# Altium schematic sheet CH32FVx0xR-NFC-EVT-R0-1v2.SchDoc
size 406 x 281 mm; SheetNumber: 0; SheetTotal: 0
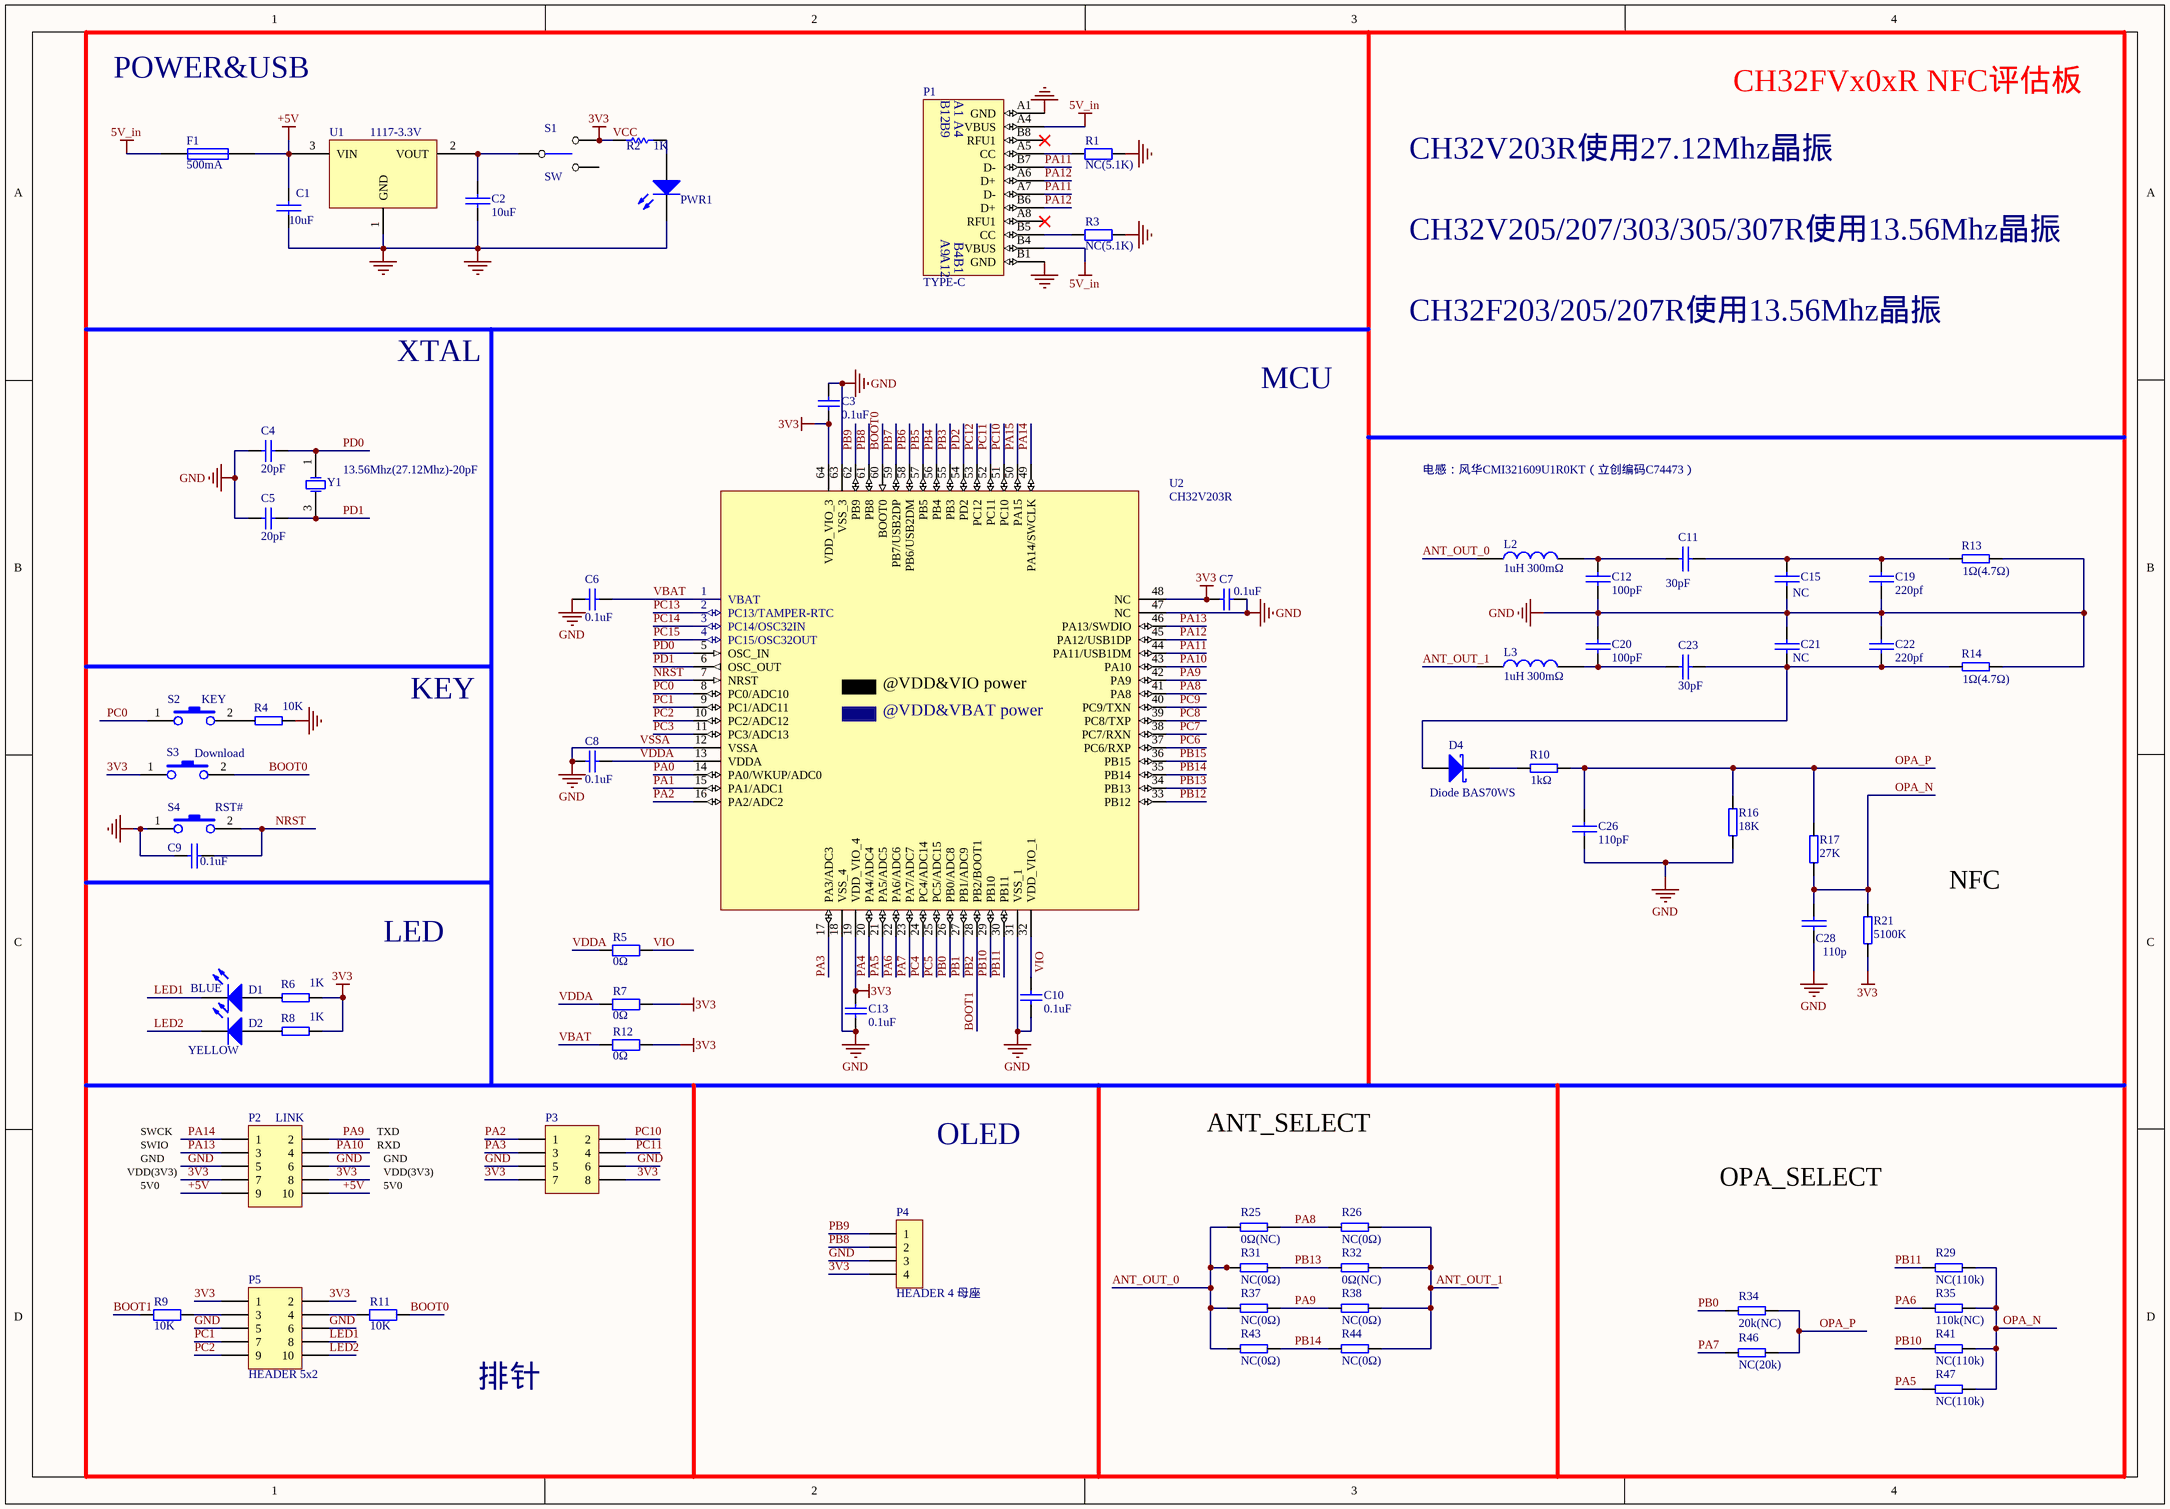
[diagram p0: CH32FVx0xR-NFC-EVT-R0-1v2.SchDoc]

## Parts
C1  10uF  [3216_C]
C2  10uF  [3216_C]
C3  0.1uF  [0603_C]
C4  20pF  [0603_C]
C5  20pF  [0603_C]
C6  0.1uF  [0603_C]
C7  0.1uF  [0603_C]
C8  0.1uF  [0603_C]
C9  0.1uF  [0603_C]
C10  0.1uF  [0603_C]
C11  30pF  [0603_C]
C12  100pF  [0603_C]
C13  0.1uF  [0603_C]
C15  NC  [0603_C]
C19  220pf  [0603_C]
C20  100pF  [0603_C]
C21  NC  [0603_C]
C22  220pf  [0603_C]
C23  30pF  [0603_C]
C26  110pF  [0603_C]
C28  110p  [0603_C]
D1  BLUE  [0603+]
D2  YELLOW  [0603+]
D4  Diode BAS70WS  [3528+]
F1  500mA  [0805]
L2  1uH 300mΩ  [0805]
L3  1uH 300mΩ  [0805]
P1  TYPE-C  [TYPE-C-Receptacle-2.0]
P2  LINK  [IDC10-2.54mm]
P3  Header 4X2  [IDC8-2.54mm]  (value not drawn)
P4  HEADER 4 母座  [SIP4-2.54mm]
P5  HEADER 5x2  [IDC10-2.54mm]
PWR1  POWER  red  [0603+]  (value not drawn)
R1  NC(5.1K)  [0603]
R2  1K  [0603]
R3  NC(5.1K)  [0603]
R4  10K  [0603]
R5  0Ω  [0603]
R6  1K  [0603]
R7  0Ω  [0603]
R8  1K  [0603]
R9  10K  [0603]
R10  1kΩ  [0603]
R11  10K  [0603]
R12  0Ω  [0603]
R13  1Ω(4.7Ω)  [0603]
R14  1Ω(4.7Ω)  [0603]
R16  18K  [0603]
R17  27K  [0603]
R21  5100K  [0603]
R25  0Ω(NC)  [0603]
R26  NC(0Ω)  [0603]
R29  NC(110k)  [0603]
R31  NC(0Ω)  [0603]
R32  0Ω(NC)  [0603]
R34  20k(NC)  [0603]
R35  110k(NC)  [0603]
R37  NC(0Ω)  [0603]
R38  NC(0Ω)  [0603]
R41  NC(110k)  [0603]
R43  NC(0Ω)  [0603]
R44  NC(0Ω)  [0603]
R46  NC(20k)  [0603]
R47  NC(110k)  [0603]
S1  SW  [SW1]
S2  KEY  [SMD_6.1x3.65x2.5mm-KEY]
S3  Download  [SMD_6.1x3.65x2.5mm-KEY]
S4  RST#  [SMD_6.1x3.65x2.5mm-KEY]
U1  1117-3.3V  [SOT-223]
U2  CH32V203R  [LQFP64M_10x10]
Y1  13.56Mhz(27.12Mhz)-20pF  [XT3225]

## Nets
3V3: C3.2 C7.2 C13.2 P2.7 P2.8 P3.7 P3.8 P4.4 P5.1 P5.2 R2.2 R6.1 R7.1 R8.1 R12.1 R21.1 S1.3 S3.1 U2.19(VDD_VIO_4) U2.48(NC) U2.64(VDD_VIO_3)  [also labelled VCC]
5V_in: F1.1 P1.A4(VBUS) P1.B4(VBUS)
+5V: C1.1 F1.2 P2.9 P2.10 U1.3(VIN)
GND: C1.2 C2.2 C3.1 C4.1 C5.1 C6.2 C7.1 C8.2 C9.1 C10.1 C12.1 C13.1 C15.1 C19.1 C20.2 C21.2 C22.2 C26.1 C28.1 P1.A1(GND) P1.B1(GND) P2.5 P2.6 P3.5 P3.6 P4.3 P5.5 P5.6 PWR1.2(K) R1.2 R3.2 R4.1 R13.2 R14.2 R16.1 S4.1 U1.1(GND) U2.12(VSSA) U2.18(VSS_4) U2.31(VSS_1) U2.47(NC) U2.63(VSS_3)  [also labelled VSSA]
ANT_OUT_0: L2.1 R25.2 R31.2 R37.2 R43.2
ANT_OUT_1: L3.1 R26.1 R32.1 R38.1 R44.1
BOOT0: R11.2 S3.2 U2.60(BOOT0)
BOOT1: R9.1 U2.28(PB2/BOOT1)  [also labelled PB2]
LED1: D1.2(K) P5.8
LED2: D2.2(K) P5.10
NRST: C9.2 S4.2 U2.7(NRST)
OPA_N: C28.2 R17.1 R21.2 R29.1 R35.1 R41.1 R47.1
OPA_P: C26.2 R10.2 R16.2 R17.2 R34.1 R46.1
PA0: U2.14(PA0/WKUP/ADC0)
PA1: U2.15(PA1/ADC1)
PA2: P3.1 U2.16(PA2/ADC2)
PA3: P3.3 U2.17(PA3/ADC3)
PA4: U2.20(PA4/ADC4)
PA5: R47.2 U2.21(PA5/ADC5)
PA6: R35.2 U2.22(PA6/ADC6)
PA7: R46.2 U2.23(PA7/ADC7)
PA8: R25.1 R26.2 U2.41(PA8)
PA9: P2.2 R37.1 R38.2 U2.42(PA9)
PA10: P2.4 U2.43(PA10)
PA11: P1.A7(D-) P1.B7(D-) U2.44(PA11/USB1DM)
PA12: P1.A6(D+) P1.B6(D+) U2.45(PA12/USB1DP)
PA13: P2.3 U2.46(PA13/SWDIO)
PA14: P2.1 U2.49(PA14/SWCLK)
PA15: U2.50(PA15)
PB0: R34.2 U2.26(PB0/ADC8)
PB1: U2.27(PB1/ADC9)
PB3: U2.55(PB3)
PB4: U2.56(PB4)
PB5: U2.57(PB5)
PB6: U2.58(PB6/USB2DM)
PB7: U2.59(PB7/USB2DP)
PB8: P4.2 U2.61(PB8)
PB9: P4.1 U2.62(PB9)
PB10: R41.2 U2.29(PB10)
PB11: R29.2 U2.30(PB11)
PB12: U2.33(PB12)
PB13: R31.1 R32.2 U2.34(PB13)
PB14: R43.1 R44.2 U2.35(PB14)
PB15: U2.36(PB15)
PC0: S2.1 U2.8(PC0/ADC10)
PC1: P5.7 U2.9(PC1/ADC11)
PC2: P5.9 U2.10(PC2/ADC12)
PC3: U2.11(PC3/ADC13)
PC4: U2.24(PC4/ADC14)
PC5: U2.25(PC5/ADC15)
PC6: U2.37(PC6/RXP)
PC7: U2.38(PC7/RXN)
PC8: U2.39(PC8/TXP)
PC9: U2.40(PC9/TXN)
PC10: P3.2 U2.51(PC10)
PC11: P3.4 U2.52(PC11)
PC12: U2.53(PC12)
PC13: U2.2(PC13/TAMPER-RTC)
PC14: U2.3(PC14/OSC32IN)
PC15: U2.4(PC15/OSC32OUT)
PD0: C4.2 U2.5(OSC_IN) Y1.1(OSC1)
PD1: C5.2 U2.6(OSC_OUT) Y1.3(OSC2)
PD2: U2.54(PD2)
VBAT: C6.1 R12.2 U2.1(VBAT)
VDDA: C8.1 R5.2 R7.2 U2.13(VDDA)
VIO: C10.2 R5.1 U2.32(VDD_VIO_1)
NetC2_1: C2.1 S1.1 U1.2(VOUT)
NetC11_1: C11.1 C12.2 L2.2
NetC11_2: C11.2 C15.2 C19.2 R13.1
NetC20_1: C20.1 C23.1 L3.2
NetC21_1: C21.1 C22.1 C23.2 D4.1(A) R14.1
NetD1_1: D1.1(A) R6.2
NetD2_1: D2.1(A) R8.2
NetD4_2: D4.2(K) R10.1
NetP1_A5: P1.A5(CC) R1.1
NetP1_B5: P1.B5(CC) R3.1
NetP5_3: P5.3 R9.2
NetP5_4: P5.4 R11.1
NetPWR1_1: PWR1.1(A) R2.1
NetR4_2: R4.2 S2.2

Not connected (* = marked no-connect by the designer): P1 A8(RFU1)* B8(RFU1)*; S1 2

## Notes on the sheet
- POWER&USB
- CH32FVx0xR NFC评估板
- CH32V203R使用27.12Mhz晶振
- CH32V205/207/303/305/307R使用13.56Mhz晶振
- XTAL
- CH32F203/205/207R使用13.56Mhz晶振
- MCU
- 电感：风华CMI321609U1R0KT（立创编码C74473）
- KEY
- NFC
- LED
- VDD(3V3)
- SWCK
- SWIO
- 5V0
- GND
- TXD
- RXD
- OLED
- ANT_SELECT
- OPA_SELECT
- 排针
- Title
- Size:
- Date:
- A3
- Number:
- Time:
- Revision:
- Sheet
- of
- File:
- (in symbol CH32V203R) @VDD&VIO power; @VDD&VBAT power
- (in symbol TYPE-C1) B12; B9; A9; A12

## Library data of the parts
C1 C2 C9 C11 C12 C15 C19-C23 C26 C28 = CAP: Capacitor
C3-C8 C10 C13 = Cap: Capacitor
D1 D2 PWR1 = LED0: Typical INFRARED GaAs LED; Published: 8-Jun-2000; LatestRevisionDate: 08-Jul-2005; LatestRevisionNote: Mech Layer 1 removed.; PackageReference: LED-0; Publisher: Altium Limited
  D1 D2: PackageDescription: LED; 2 Leads
D4 = Diode BAS70: Silicon AF Schottky Diode for High-Speed Switching; Note: Pin 2 is not connected and not drawn.; Published: 21-Mar-2003; LatestRevisionDate: 29-May-2009; LatestRevisionNote: IPC-7351 Footprint Added.; DatasheetVersion: Oct-1999; PackageVersion: Sep-2001; PackageReference: SOT-23; Publisher: Altium Limited; PackageDescription: 3-Pin SOT-23 Package 0.95 mm Pitch, 2.5 mm Lead Span; ComponentLink1Description: Manufacturer Link; ComponentLink1URL: http://www.infineon.com/; ComponentLink2Description: Datasheet; ComponentLink2URL: http://www.infineon.com/upload/Document/cmc_upload/documents/009/382/bas40_bas140series_1.pdf
F1 = FUSE1: Fuse
L2 L3 = INDUCTOR
P1 = TYPE-C1
P2 = Header 5X2H: Header, 5-Pin, Dual row, Right Angle; LatestRevisionDate: 17-Jul-2002; LatestRevisionNote: Re-released for DXP Platform.; Publisher: Altium Limited
P3 = Header 4X2: Header, 4-Pin, Dual row; LatestRevisionDate: 17-Jul-2002; LatestRevisionNote: Re-released for DXP Platform.; Publisher: Altium Limited
P4 = HEADER 4: Header, 4-Pin
P5 = HEADER 5x2: Header, 5-Pin, Dual row
R1 R3 R5 R7 R9 R11 R12 = Res2: Resistor
R2 = Res Semi: Semiconductor Resistor
R4 R6 R8 R10 R13 R14 R16 R17 R21 R25 R26 R29 R31 R32 R34 R35 R37 R38 R41 R43 R44 R46 R47 = RES
S2-S4 = KEY1
U2 = CH32V203R: RISC-V HD-MCU, 10M Ethernet, 2*USB, CAN
Y1 = XTAL: Crystal Oscillator; Published: 8-Jun-2000; LatestRevisionDate: 17-Jul-2002; LatestRevisionNote: Re-released for DXP Platform.; PackageReference: R38; Publisher: Altium Limited